# Altium schematic sheet Common_Drain_Inductor_Balancer.SchDoc
size A; SheetNumber: 1; SheetTotal: 1
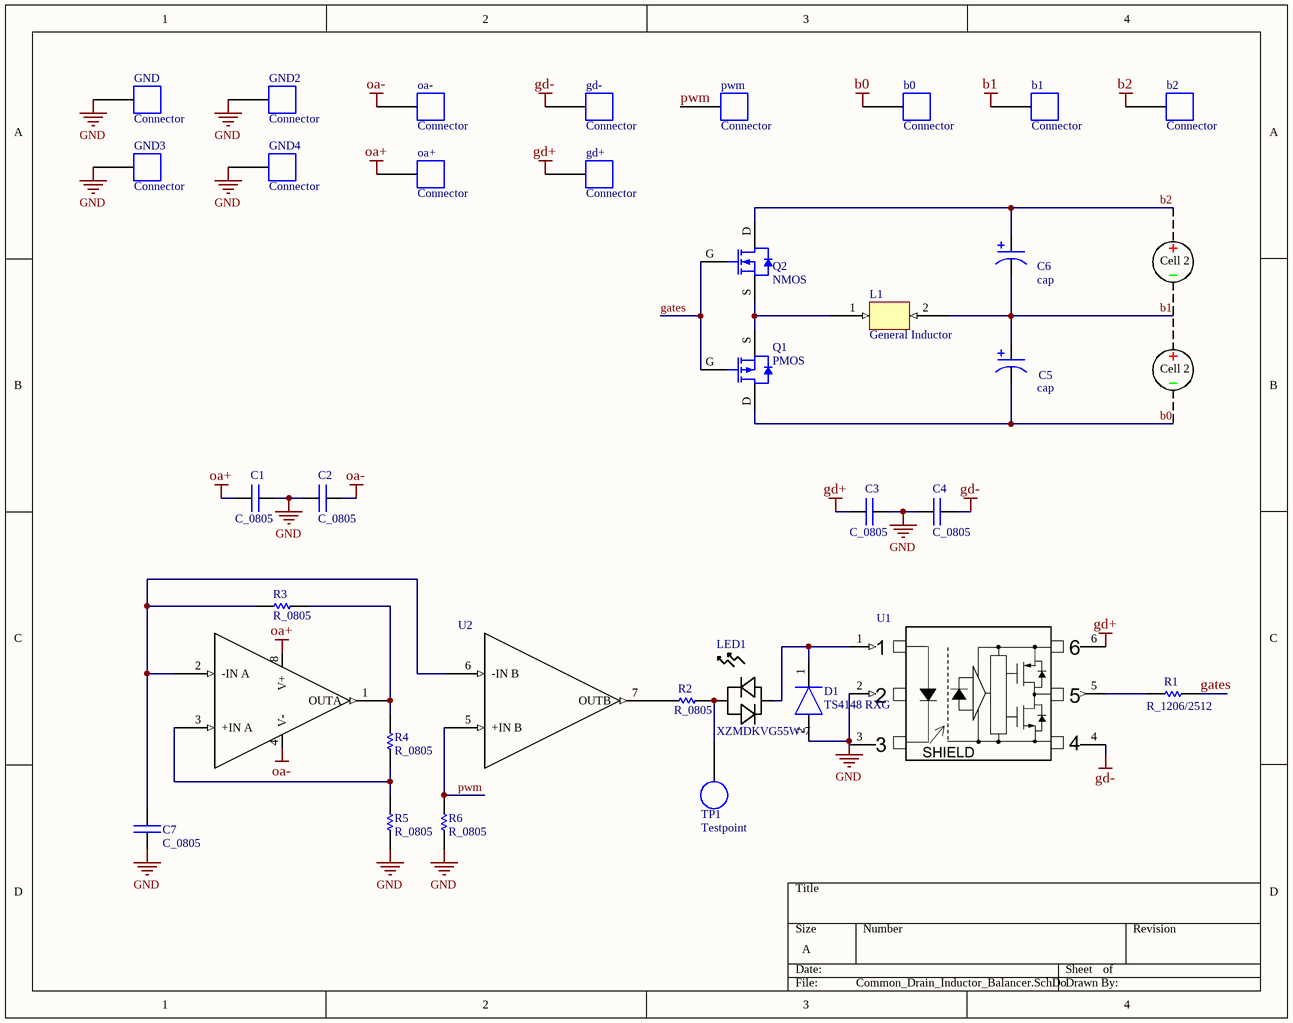
[diagram p0: Common_Drain_Inductor_Balancer.SchDoc]

## Parts
b0  Connector  [connector_large]  (no BOM)
b1  Connector  [connector_large]  (no BOM)
b2  Connector  [connector_large]  (no BOM)
C1  C_0805  [CAPC2012X14N]
C2  C_0805  [CAPC2012X14N]
C3  C_0805  [CAPC2012X14N]
C4  C_0805  [CAPC2012X14N]
C5  cap  [cap_by]
C6  cap  [cap_by]
C7  C_0805  [CAPC2012X14N]
D1  TS4148 RXG  [DIOC3215X08N]
gd+  Connector  [connector_large]  (no BOM)
gd-  Connector  [connector_large]  (no BOM)
GND  Connector  [connector_large]  (no BOM)
GND2  Connector  [connector_large]  (no BOM)
GND3  Connector  [connector_large]  (no BOM)
GND4  Connector  [connector_large]  (no BOM)
L1  General Inductor  [Inductor_v1]
LED1  XZMDKVG55W-7  [DIOC3216X18N]
oa+  Connector  [connector_large]  (no BOM)
oa-  Connector  [connector_large]  (no BOM)
pwm  Connector  [connector_large]  (no BOM)
Q1  PMOS  [PMOS]
Q2  NMOS  [NMOS]
R1  R_1206/2512  [RESC6331X06N]
R2  R_0805  [RESC2012X06N]
R3  R_0805  [RESC2012X06N]
R4  R_0805  [RESC2012X06N]
R5  R_0805  [RESC2012X06N]
R6  R_0805  [RESC2012X06N]
TP1  Testpoint  [testpoint]  (no BOM)
U1  TLP5774  [SOIC127P1000X220-6N]  (value not drawn)
U2  OPA2197  [SOIC127P600X175-8N]  (value not drawn)

## Nets
b0: b0.1 C5.2 Q1.D
b1: b1.1 C5.1 C6.2 L1.2
b2: b2.1 C6.1 Q2.D
gd+: C3.1 gd+.1 U1.6(VCC)
gd-: C4.2 gd-.1 U1.4(GND)
GND: C1.2 C2.1 C3.2 C4.1 C7.2 D1.2(A) GND.1 GND2.1 GND3.1 GND4.1 R5.1 R6.1 U1.2(N.C.) U1.3(Cathode)
oa+: C1.1 oa+.1 U2.8(V+)
oa-: C2.2 oa-.1 U2.4(V-)
gates: Q1.G Q2.G R1.2
pwm: pwm.1 R6.2 U2.5(+IN_B)
NetC7_1: C7.1 R3.2 U2.2(-IN_A) U2.6(-IN_B)
NetD1_1: D1.1(C) LED1.2 U1.1(Anode)
NetL1_1: L1.1 Q1.S Q2.S
NetLED1_1: LED1.1 R2.2 TP1.1
NetR1_1: R1.1 U1.5(VO)
NetR2_1: R2.1 U2.7(OUTB)
NetR3_1: R3.1 R4.1 U2.1(OUTA)
NetR4_2: R4.2 R5.2 U2.3(+IN_A)

## Notes on the sheet
- Cell 2

## Library data of the parts
b0-b2 = Connector: RoomCode: PowerConnectors
C3 C4 = C_0805: RoomCode: U1
C5 C6 = cap: RoomCode: Power
C7 = C_0805: RoomCode: U2
D1 = TS4148 RXG: RoomCode: LED
L1 = General Inductor-Symbol-1: RoomCode: Power
LED1 = XZMDKVG55W-7: No Description Available; Manufacturer_Part_Number: XZMDKVG55W-4; Built_By: EMA_Matt; Vendor: SunLED; SourceLibrary: SunLED_2020-06-23; Type: DEV; RoomCode: LED; Datasheet: https://www.sunledusa.com/products/spec/XZMDKVG55W-4.pdf; Copyright: Copyright (C) 2018 Accelerated Designs. All rights reserved; RefDes: RefDes
Q1 = PMOS: RoomCode: Power
Q2 = NMOS: RoomCode: Power
R1 = R_1206/2512: RoomCode: U1
R2 = R_0805: RoomCode: LED
R3-R6 = R_0805: RoomCode: U2
TP1 = Testpoint: RoomCode: LED
U1 = TLP5774: RoomCode: U1
U2 = OPA2197: RoomCode: U2